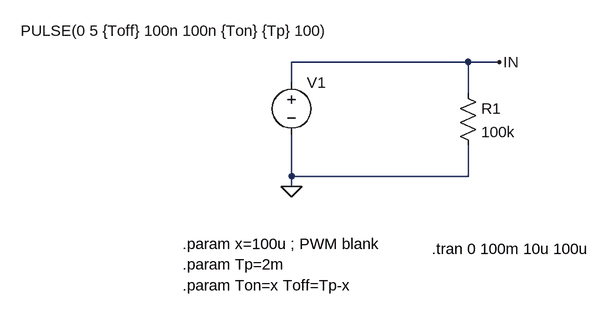
[diagram p0: schematic DAC_PULS20.asc]
DAC_PULS20.asc, the LTspice schematic file:
Version 4
SHEET 1 880 680
WIRE 480 32 208 32
WIRE 528 32 480 32
WIRE 208 64 208 32
WIRE 480 80 480 32
WIRE 208 208 208 144
WIRE 480 208 480 160
WIRE 480 208 208 208
WIRE 208 224 208 208
FLAG 208 224 0
FLAG 528 32 IN
DATAFLAG 560 32 ""
SYMBOL voltage 208 48 R0
WINDOW 3 -417 -64 Left 2
WINDOW 123 0 0 Left 0
WINDOW 39 0 0 Left 0
SYMATTR Value PULSE(0 5 {Toff} 100n 100n {Ton} {Tp} 100)
SYMATTR InstName V1
SYMBOL res 464 64 R0
SYMATTR InstName R1
SYMATTR Value 100k
TEXT 40 312 Left 2 !.param x=100u ; PWM blank
TEXT 424 320 Left 2 !.tran 0 100m 10u 100u
TEXT 40 376 Left 2 !.param Ton=x Toff=Tp-x
TEXT 40 344 Left 2 !.param Tp=2m

The netlist it stands for:
* DAC_PULS20.asc
V1 IN 0 PULSE(0 5 {Toff} 100n 100n {Ton} {Tp} 100)
R1 IN 0 100k
.param x=100u ; PWM blank
.tran 0 100m 10u 100u
.param Ton=x Toff=Tp-x
.param Tp=2m
.backanno
.end